# EAGLE design schematic (EAGLE 7.6.0)
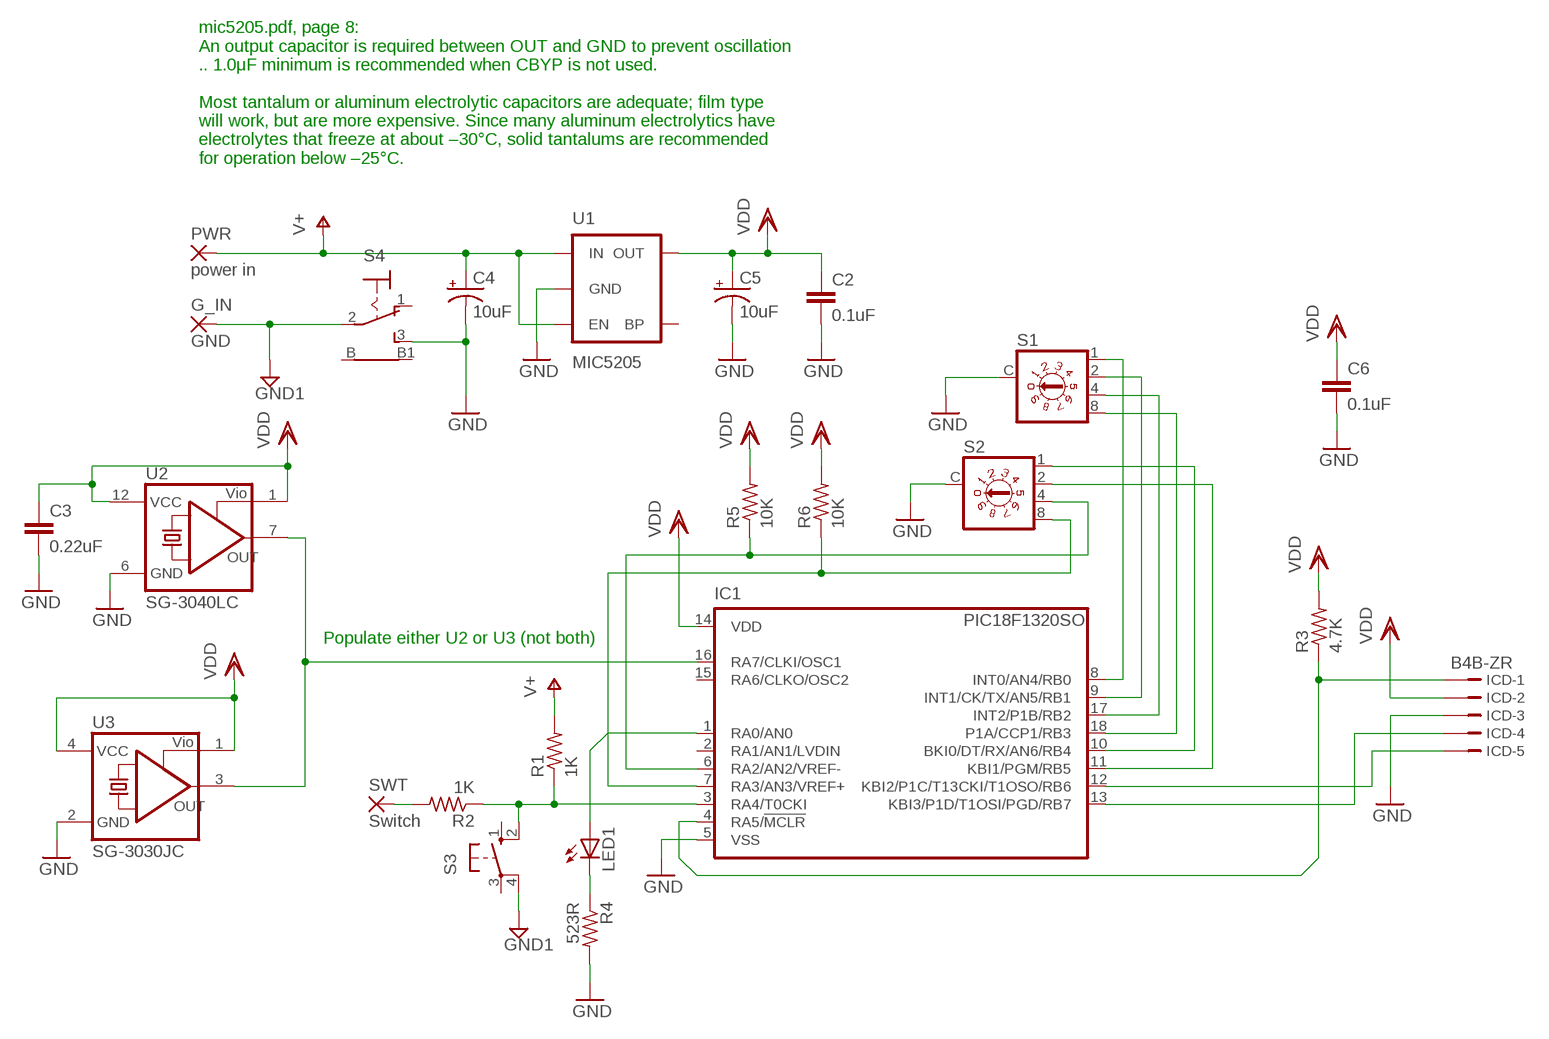
[diagram p0: schematic, sheet 1]

## Parts
C2  0.1uF  C2,5-3  [C2.5-3]
C3  0.22uF  C2,5-3  [C2.5-3]
C4  10uF  CAP_POL1206  [EIA3216]
C5  10uF  CAP_POL1206  [EIA3216]
C6  0.1uF  C2,5-3  [C2.5-3]
G_IN  GND  2,15/1,0  [2,15/1,0]
IC1  PIC18F1320SO  PIC18F1220SO  [SO-18W]
ICD  B4B-ZR  [B5B-EH]
LED1  LED3MM  [LED3MM]
PWR  power in  2,15/1,0  [2,15/1,0]
R1  1K  R-US_0204/2V  [0204V]
R2  1K  R-US_0204/2V  [0204V]
R3  4.7K  R-US_0204/2V  [0204V]
R4  523R  R-US_0204/2V  [0204V]
R5  10K  R-US_0204/2V  [0204V]
R6  10K  R-US_0204/2V  [0204V]
S1  P101  [P101]
S2  P101  [P101]
S3  10-XX  [B3F-10XX]
S4  C&K_E101  [C&K_E101MD1ABE]
SWT  Switch  2,15/1,0  [2,15/1,0]
U1  MIC5205  V_REG_LDOSMD  [SOT23-5]
U2  SG-3040LC  SG-3030,40(LC,JC,JF)LC-LARGE  [SOJ-12-L]
U3  SG-3030JC  SG-3030,40(LC,JC,JF)JC  [JC_TYPE]

## Nets
CLK: IC1.16(RA7/CLKI/OSC1) U2.7(OUT) U3.3(OUT)
GND1: G_IN.1(P) S3.4(P1) S4.2(P)
N$1: IC1.3(RA4/T0CKI) R1.1 R2.1 S3.2(S1)
N$2: IC1.10(BKI0/DT/RX/AN6/RB4) S2.1
N$3: R2.2 SWT.1(P)
N$4: IC1.6(RA2/AN2/VREF-) R5.1 S2.4
N$5: IC1.7(RA3/AN3/VREF+) R6.1 S2.8
N$6: IC1.4(RA5/!MCLR) ICD.1 R3.1
N$7: IC1.13(KBI3/P1D/T1OSI/PGD/RB7) ICD.4
N$8: IC1.12(KBI2/P1C/T13CKI/T1OSO/RB6) ICD.5
N$9: IC1.11(KBI1/PGM/RB5) S2.2
N$10: IC1.1(RA0/AN0) LED1.A
N$11: LED1.K(C) R4.1
N$12: C2.2 C3.2 C4.C(-) C5.C(-) C6.2 IC1.5(VSS) ICD.3 R4.2 S1.C S2.C S4.3(S) U1.2(GND) U2.6(GND) U3.2(GND) ; supply symbol labelled GND
SWITCH_OUT_0: IC1.8(INT0/AN4/RB0) S1.1
SWITCH_OUT_1: IC1.9(INT1/CK/TX/AN5/RB1) S1.2
SWITCH_OUT_2: IC1.17(INT2/P1B/RB2) S1.4
SWITCH_OUT_3: IC1.18(P1A/CCP1/RB3) S1.8
V+: C4.A(+) PWR.1(P) R1.2 U1.1(IN) U1.3(EN)
VDD: C2.1 C3.1 C5.A(+) C6.1 IC1.14(VDD) ICD.2 R3.2 R5.2 R6.2 U1.5(OUT) U2.1(VIO) U2.12(VCC) U3.1(VIO) U3.4(VCC)
Unconnected: IC1.2(RA1/AN1/LVDIN) IC1.15(RA6/CLKO/OSC2) S3.1(S) S3.3(P) S4.1(O) S4.B S4.B1 U1.4(BP)

## Notes on the sheet
- mic5205.pdf, page 8: 
  An output capacitor is required between OUT and GND to prevent oscillation 
  .. 1.0μF minimum is recommended when CBYP is not used.
  
  Most tantalum or aluminum electrolytic capacitors are adequate; film type 
  will work, but are more expensive. Since many aluminum electrolytics have 
  electrolytes that freeze at about –30°C, solid tantalums are recommended 
  for operation below –25°C.
- Populate either U2 or U3 (not both)

## Library data of the parts
C2 C3 C6 = capacitor-wima:C: CAPACITOR naming: grid - package width
C4 C5 = SparkFun:CAP_POL: Capacitor Polarized These are standard SMD and PTH capacitors. Normally 10uF, 47uF, and 100uF in electrolytic and tantalum varieties. Always verify the external diameter of the through hole cap, it varies with capacity, voltage, and manufacturer. The EIA devices should be standard.
G_IN PWR SWT = wirepad:2,15/1,0: THROUGH-HOLE PAD
IC1 = microchip:PIC18F1*20: 18/20/28-Pin High-Performance, Enhanced Flash Microcontrollers with 10-bit A/D and nanoWatt Technology Source: ww1.microchip.com/downloads/en/DeviceDoc/39605c.pdf; MF: MICROCHIP; MPN: PIC18F1220-I/SO; OC_FARNELL: 9761985; OC_NEWARK: 92C2430
ICD = untitled:?4B-ZR: EH CONNECTOR Top entry type, 2.5 mm, 5 pin 1 row Top entry Source: http://www.jst.com .. eEH_connector.pdf; MF: FARNELL; MPN: B4B-ZR(LF)(SN); OC_FARNELL: 1830916; OC_NEWARK: 37K9960
LED1 = Testing:LED: LEDs Standard schematic elements and footprints for 5mm, 3mm, 1206, and 0603 sized LEDs. 5mm - Spark Fun Electronics SKU : COM-00529 (and others)
R1-R6 = resistor:R-US_: RESISTOR, American symbol
S1 S2 = switch-dil:P101: DIL/CODE SWITCH; OC_FARNELL: unknown; OC_NEWARK: unknown
S3 = switch-omron:10-XX: OMRON SWITCH; MPN: B3F-1000; OC_FARNELL: 176432; OC_NEWARK: 36M3542
S4 = untitled:C&K_E101: SPDT TOGGLE SWITCH C&K Components Digi-Key: CKN1060-ND E:/vDocs/General/ALFA/LED/C_K_E101MD1ABE_etoggle.pdf center terminal is Common
U1 = SparkFun:V_REG_LDO: Voltage Regulator LDO Standard 150mA LDO voltage regulator in SOT-23 layout. Micrel part MIC5205. BP (by-pass) pin is used to lower output noise with 470pF cap.
U2 U3 = untitled:SG-3030,40(LC,JC,JF): Crystal Oscillator 32.768 kHz SG-3030,40(LC,JC,JF)_Series.pdf Part number source SG-3030LC - SG-3040LC digiKey: SER3697CT-ND SG-3030JF mouser: 732-SG3030JF32.7B3R, digiKey min quantity 250 SG-3030JC digiKey: SER3618CT-ND DigiKey package names LC: 12-SOJ 0.5mm pitch (3.60mm x 2.40mm) JF: 4-SOJ (7.10mm x 4.60mm) JC: 4-SOJ 5.08mm pitch

## Board
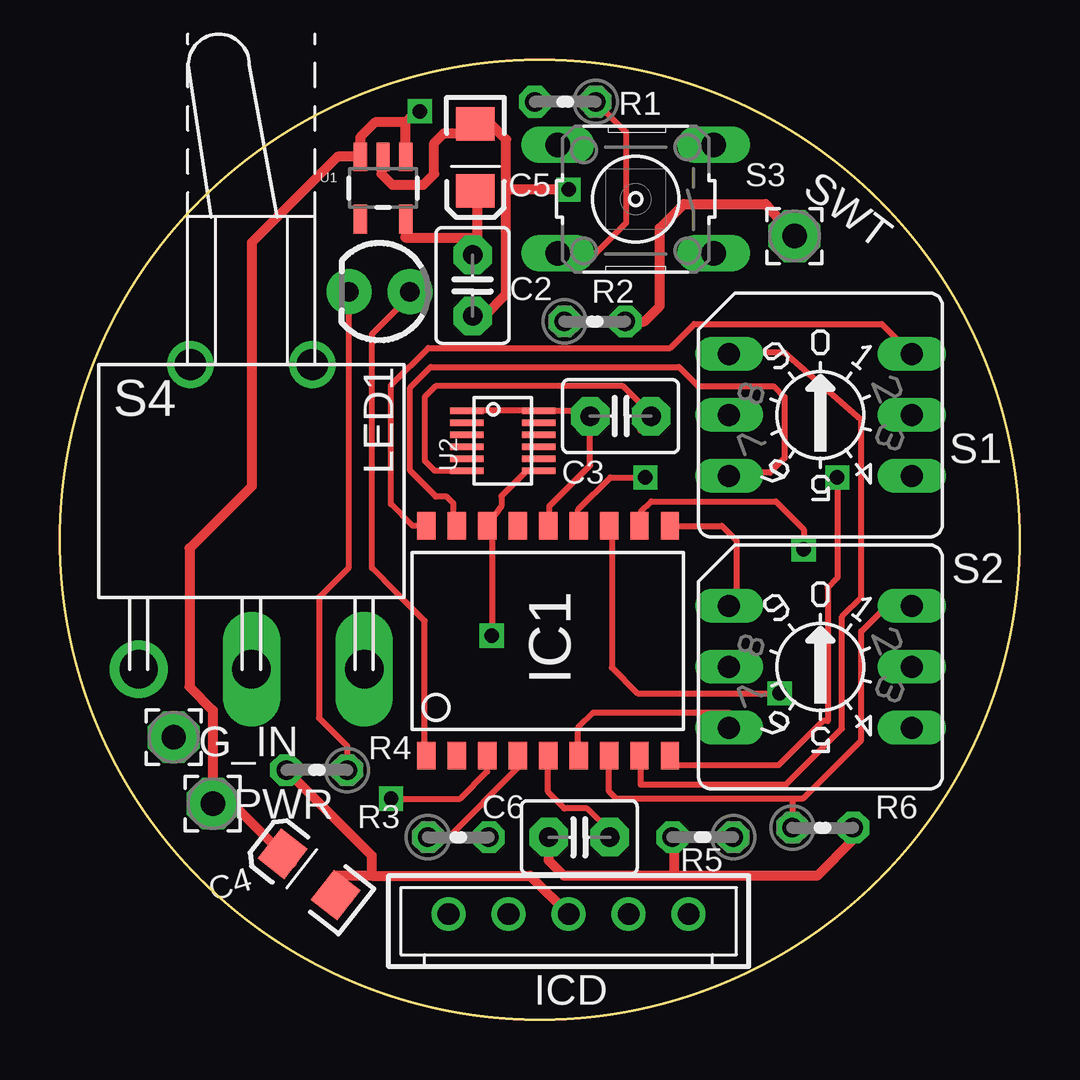
[diagram p1: board, top side]
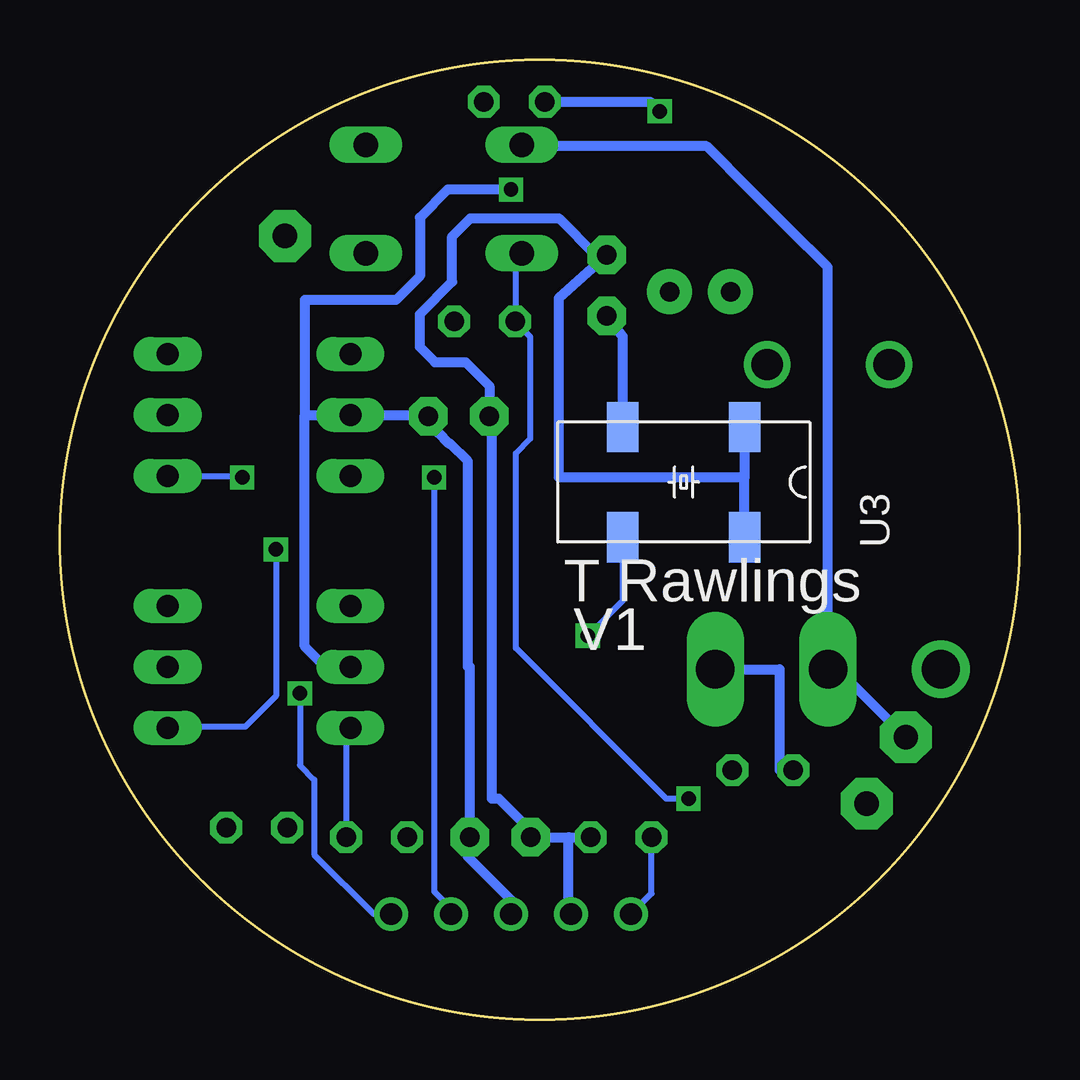
[diagram p2: board, bottom side, seen from below]

Size 40 x 40 mm. Coordinates in mm from the lower left corner, seen from the top.
Outline: circle at 20,20 radius 20
Copper layers (1*16): Top 0.035mm / dielectric 1.5mm / Bottom 0.035mm
Design rules "default *": minimum track width 0.2mm, minimum drill 0.4mm, track to track 0.2mm, track to pad 0.2mm, pad to pad 0.2mm, via to via 0.2mm, smd to smd 0.2mm, copper to edge 20mil, drill to drill 8mil, minimum pad ring 10mil, minimum via ring 8mil, stop-mask expansion 4mil, vias tented up to drill 0mil, thermal gap 10mil

### Footprints (pad centres in the part's own frame; a part is rotated, then mirrored left to right if it is on the bottom)
C2.5-3 = drill 0.813 pad 1.6 octagon: 1 -1.27,0; 2 1.27,0
EIA3216 = smd 1.4 x 1.6: A 1.4,0; C -1.4,0
2,15/1,0 = drill 1.016 pad 2.159 octagon: 1 0,0
SO-18W = smd 0.762 x 1.143: 1 -5.08,-4.788; 2 -3.81,-4.788; 3 -2.54,-4.788; 4 -1.27,-4.788; 5 0,-4.788; 6 1.27,-4.788; 7 2.54,-4.788; 8 3.81,-4.788; 9 5.08,-4.788; 10 5.08,4.788; 11 3.81,4.788; 12 2.54,4.788; 13 1.27,4.788; 14 0,4.788; 15 -1.27,4.788; 16 -2.54,4.788; 17 -3.81,4.788; 18 -5.08,4.788
B5B-EH = drill 0.9: 1 -5,0; 2 -2.5,0; 3 0,0; 4 2.5,0; 5 5,0
LED3MM = drill 0.813 pad 1.88: A -1.27,0; K 1.27,0
0204V = drill 0.813 octagon: 1 -1.27,0; 2 1.27,0
P101 = drill 0.914 long: 1 3.81,-2.54; 2 -3.81,2.54; 4 3.81,2.54; 8 -3.81,-2.54; C 3.81,0; C1 -3.81,0
B3F-10XX = drill 1.016 long: 1 -3.251,2.261; 2 3.251,2.261; 3 -3.251,-2.261; 4 3.251,-2.261
C&K_E101MD1ABE = drill 1.6: 1 0,-4.7 | drill 1.6 long: 2 0,0; 3 0,4.7 | drill 1.3: B -12.7,-2.54; B1 -12.7,2.54
SOT23-5 = smd 0.55 x 1.2: 1 -0.95,-1.3; 2 0,-1.3; 3 0.95,-1.3; 4 0.95,1.3; 5 -0.95,1.3
SOJ-12-L = smd 0.27 x 1.4: 1 -1.25,-1.5; 2 -0.75,-1.5; 3 -0.25,-1.5; 4 0.25,-1.5; 5 0.75,-1.5; 6 1.25,-1.5; 7 1.25,1.5; 8 0.75,1.5; 9 0.25,1.5; 10 -0.25,1.5; 11 -0.75,1.5; 12 -1.25,1.5
JC_TYPE = smd 1.3 x 2.1: 1 -2.54,-2.3; 2 2.54,-2.3; 3 2.54,2.3; 4 -2.54,2.3

### Placement (x,y rotation side)
C2  17.2,30.6 270 top
C3  23.37,25.15 0 top
C4  10.38,6.05 142 top
C5  17.32,35.94 270 top
C6  21.65,7.6 0 top
G_IN  4.74,11.77 90 top
IC1  20.35,15.79 0 top
ICD  21.2,4.4 0 top
LED1  13.32,30.34 180 top
PWR  6.37,9 0 top
R1  21.06,38.26 180 top
R2  22.3,29.1 0 top
R3  16.61,7.6 0 top
R4  10.7,10.4 180 top
R5  26.8,7.6 180 top
R6  31.8,8 0 top
S1  31.7,25.2 180 top
S2  31.7,14.7 180 top
S3  24,34.2 180 top
S4  7.98,14.6 270 top
SWT  30.62,32.66 0 top
U1  13.47,34.66 180 top
U2  18.46,24.13 270 top
U3  14,22.4 180 bottom

### Tracks (layer width: path | path; a pad name or v marks a point on that pad's centre or on a via)
CLK  (via drill 0.6)
  Top 0.254: U2.7 19.46,22.88 18.4,21.82 18.4,21.4 IC1.16 17.6,20.46 18,20.46 v18,16
  Bottom 0.254: v18,16 16.54,17.46 U3.3
GND1
  Bottom 0.406: G_IN.1 7.57,14.6 S4.2 8,14.6 8,31.36 9.64,33 11.2,34.56 13.04,36.4 20.75,36.4 S3.4
N$1  (via drill 0.6)
  Top 0.254: 17.6,10.63 IC1.3 17.81,10.34 16.67,9.2 14.2,9.2 v13.8,9.21 | R1.1 23.6,36.99 23.6,33.2 22.34,31.94 S3.2
  Bottom 0.254: S3.2 20.75,32 21,32 21,29.1 R2.1 20.4,28.46 20.4,24.2 21,23.6 21,15.48 14.72,9.21 v13.8,9.21
N$2
  Top 0.254: IC1.10 27.59,20.58 28.2,19.97 28.2,17.2 27.89,17.2 S2.1
N$3
  Top 0.406: R2.2 24.36,29.1 25,29.74 25,33 26,34 29.42,34 SWT.1
N$4
  Top 0.254: 21.8,11 IC1.6 21.6,11 21.6,12.17 22.23,12.8 27.89,12.8 S2.4
  Bottom 0.254: S2.4 28.07,12.16 R5.1
N$5
  Top 0.254: 22.8,11 IC1.7 22.89,9.51 23.2,9.2 30.53,9.2 | 30.53,9.2 30.96,9.2 33.4,11.64 33.4,16.18 34.42,17.2 35.51,17.2 S2.8 | 30.53,9.2 R6.1
N$6
  Top 0.254: 18.98,10.63 IC1.4 19.08,10.48 16.2,7.6 R3.1
  Bottom 0.254: ICD.1 15.34,5.26 R3.1
N$7  (via drill 0.6)
  Top 0.254: IC1.13 21.6,20.58 21.6,21.26 22.94,22.6 v24.4,22.6
  Bottom 0.254: v24.4,22.6 24.4,5.34 23.7,4.64 ICD.4
N$8  (via drill 0.6)
  Top 0.254: IC1.12 23,20.58 23,14.68 24.08,13.6 v30,13.6
  Bottom 0.254: v30,13.6 30,10.6 29.4,10 29.4,6.87 26.93,4.4 ICD.5
N$9  (via drill 0.6)
  Top 0.254: IC1.11 24.2,20.58 24.2,21.15 24.65,21.6 29.83,21.6 31,20.43 v31,19.6
  Bottom 0.254: v31,19.6 31,13.48 32.28,12.2 35.51,12.2 S2.2
N$10
  Top 0.254: IC1.1 15.2,11 15.2,16.62 14.02,17.8 13,18.82 13,28.57 13.43,29 14.59,30.16 LED1.A
N$11
  Top 0.254: R4.1 11.97,11.4 10.8,12.57 10.8,17.6 12.05,18.85 LED1.K
N$12  (via drill 0.6)
  Top 0.254: C3.2 24.2,24.55 24.2,25.68 23.48,26.4 15.65,26.4 15.2,25.95 15.2,23.3 15.62,22.88 U2.6 | IC1.5 20.35,9.48 21.03,8.8 21.98,8.8 22.92,7.86 C6.2
  Top 0.406: U1.2 13.4,35.96 13.4,35.25 13.85,34.8 15.15,34.8 15.6,35.25 15.6,36.54 16,36.94 17.32,36.94 C5.C | 13,6 19.6,6 ICD.3 | 13,6 13,6.83 R4.2 | 17.86,37.34 C5.C | 13,6 11.48,6 C4.C | C2.2 17.7,29.33 18.6,30.23 18.6,34.6 | 18.6,34.6 18.6,36.68 17.88,37.4 17.32,37.4 C5.C | v21.2,34.6 18.6,34.6
  Bottom 0.406: v21.2,34.6 23.83,34.6 25,33.43 25,31 26,30 29.8,30 29.8,25.2 | S2.C 28.95,14.7 29.8,15.55 29.8,25.2 | 29.8,25.2 S1.C 24.24,25.2 C3.2 24.24,24.47 23.77,24 23.72,24 23,23.28 23,14.7 22.92,14.7 C6.2 23,7.6 23,6.79 21.2,4.99 ICD.3 | R4.2 10,10.4 10,14.6 S4.3 | U3.2 16.54,28.47 C2.2
SWITCH_OUT_0
  Top 0.254: IC1.8 24.2,11 24.2,9.8 30.27,9.8 32.6,12.13 32.6,16.8 33.4,17.6 33.4,24.99 30.19,27.8 27.89,27.8 S1.1
SWITCH_OUT_1  (via drill 0.6)
  Top 0.254: v32.4,22.6 32.4,18.4 32,18 32,12.44 31.8,12.44 29.96,10.6 25.43,10.6 IC1.9
  Bottom 0.254: S1.2 32.4,22.66 v32.4,22.6
SWITCH_OUT_2
  Top 0.254: IC1.17 16.4,20.58 16.4,21.52 16.12,21.8 15.68,21.8 14.6,22.88 14.6,26.35 15.45,27.2 25.8,27.2 26,27 26.6,26.4 29.75,26.4 30.2,25.95 30.2,23.4 29.6,22.8 27.89,22.8 S1.4
SWITCH_OUT_3
  Top 0.254: IC1.18 14.71,20.58 13.8,21.48 13.8,26.44 15.36,28 25.45,28 26.45,29 34.25,29 S1.8
V+  (via drill 0.6)
  Top 0.406: U1.1 14.4,35.96 14.4,37.4 | 14.4,37.4 13.14,37.4 12.52,36.77 U1.3 11.56,35.96 8,32.4 8,22.24 5.4,19.64 5.4,13.87 6.37,12.89 PWR.1 7.19,9 C4.A 9.66,6.51 | 14.4,37.4 14.8,37.8 15,37.8 v15,37.86
  Bottom 0.406: R1.2 15.4,38.26 v15,37.86
VDD
  Top 0.254: U2.1 U2.12 21.7,25.38 C3.1 22.1,23.1 20.4,21.4 20.4,20.58 IC1.14
  Top 0.406: 25.6,6 31.57,6 33.07,7.5 R6.2 | 25.6,6 21,6 20.38,6.62 C6.1 | C2.1 17.4,32.6 | 17.4,32.6 17.4,34.54 C5.A | U1.5 14.4,33.36 14.4,32.6 17.4,32.6 | R5.2 25.6,7.6 25.6,6
  Bottom 0.406: 18.8,7.6 C6.1 20.38,7.88 21.7,9.2 22,9.2 22,25 C3.1 22.1,26.41 23.09,27.4 24.37,27.4 25,28.03 25,29.4 23.65,30.75 23.65,32.64 22.89,33.4 19.2,33.4 17.67,31.87 C2.1 19.2,30.07 19.2,22.6 11.46,22.6 | 18.8,7.6 R3.2 | ICD.2 18.8,4.4 18.8,7.6 | U3.4 11.46,22.6 | U3.1 11.46,22.6

### Text on the board
bNames: T Rawlings | V1